# Altium schematic sheet LANtoLIN.SchDoc
size A4
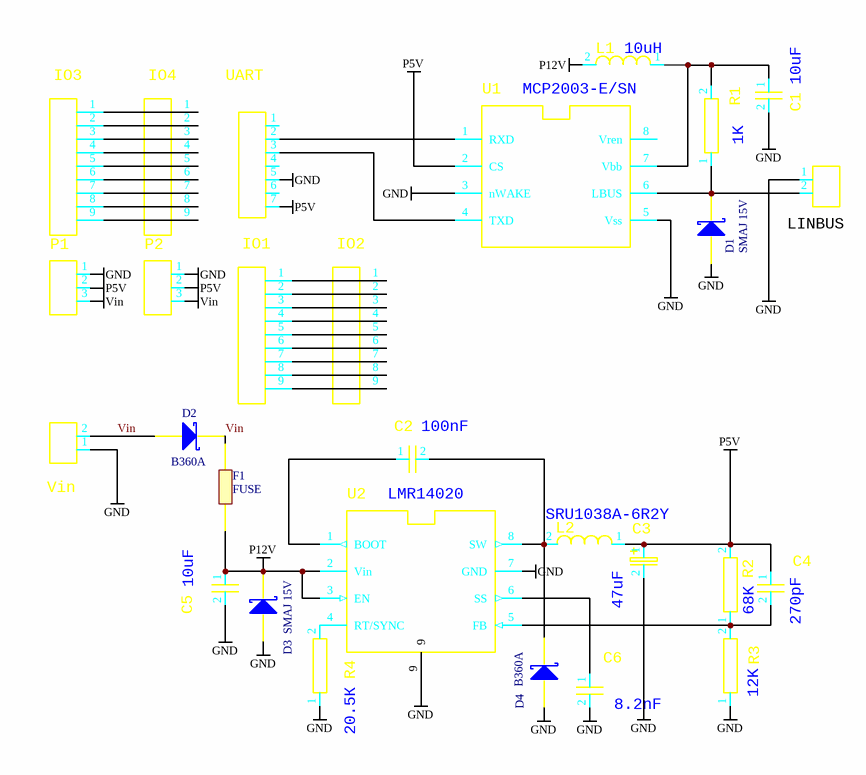
[diagram p0: LANtoLIN.SchDoc]

## Parts
C1  10uF  [C1210_N]
C2  100nF  [0805_N_2]
C3  47uF  [TANT_CASE_E]
C4  270pF  [1608[0603]]
C5  10uF  [C1210_N]
C6  8.2nF  [1608[0603]]
D1  SMAJ 15V  [SMA]
D2  B360A  [SMA]
D3  SMAJ 15V  [SMA]
D4  B360A  [SMA]
F1  FUSE  [CAPC4532L]
IO1  HEADER 9P S MALE  [CON-SRS-9-0254]  (value not drawn)
IO2  HEADER 9P S MALE  [CON-SRS-9-0254]  (value not drawn)
IO3  HEADER 9P S MALE  [CON-SRS-9-0254]  (value not drawn)
IO4  HEADER 9P S MALE  [CON-SRS-9-0254]  (value not drawn)
L1  10uH  [C1210_N]
L2  SRU1038A-6R2Y  [3232DZ (3232)]
LINBUS  2.54mm HEADER 2 PIN  [284391-2]  (value not drawn)
P1  HEADER 3P S MALE  [con-srs-3-0254]  (value not drawn)
P2  HEADER 3P S MALE  [con-srs-3-0254]  (value not drawn)
R1  1K  [C1210_N]
R2  68K  [1608[0603]]
R3  12K  [1608[0603]]
R4  20.5К  [1608[0603]]
U1  MCP2003-E/SN  [SO8 (REFLOW)]
U2  LMR14020  [S_SO8_POWER_PAD (wave)]
UART  HEADER 7P S MALE  [CON-SRS-7-0254]  (value not drawn)
Vin  2.54mm HEADER 2 PIN  [284391-2]  (value not drawn)

## Nets
GND: C1.2 C3.2 C5.2 C6.2 D1.1(A) D3.1(A) D4.1(A) LINBUS.1 P1.1 P2.1 R3.1 R4.1 U1.3(nWAKE) U1.5(Vss) U2.7(GND) U2.9 UART.5 Vin.1
P5V: C3.1 C4.1 L2.1 P1.2 P2.2 R2.2 U1.2(CS) UART.7
P12V: C5.1 D3.2(K) F1.1(A) L1.2 U2.2(Vin) U2.3(EN)
Vin: D2.1(A) D2.2(K) F1.2(K) P1.3 P2.3 Vin.2
NetC1_1: C1.1 L1.1 R1.2 U1.7(Vbb)
NetC2_1: C2.1 U2.1(BOOT)
NetC2_2: C2.2 D4.2(K) L2.2 U2.8(SW)
NetC4_2: C4.2 R2.1 R3.2 U2.5(FB)
NetC6_1: C6.1 U2.6(SS)
NetD1_2: D1.2(K) LINBUS.2 R1.1 U1.6(LBUS)
NetIO1_1: IO1.1 IO2.1
NetIO1_2: IO1.2 IO2.2
NetIO1_3: IO1.3 IO2.3
NetIO1_4: IO1.4 IO2.4
NetIO1_5: IO1.5 IO2.5
NetIO1_6: IO1.6 IO2.6
NetIO1_7: IO1.7 IO2.7
NetIO1_8: IO1.8 IO2.8
NetIO1_9: IO1.9 IO2.9
NetIO3_1: IO3.1 IO4.1
NetIO3_2: IO3.2 IO4.2
NetIO3_3: IO3.3 IO4.3
NetIO3_4: IO3.4 IO4.4
NetIO3_5: IO3.5 IO4.5
NetIO3_6: IO3.6 IO4.6
NetIO3_7: IO3.7 IO4.7
NetIO3_8: IO3.8 IO4.8
NetIO3_9: IO3.9 IO4.9
NetR4_2: R4.2 U2.4(RT/SYNC)
NetU1_1: U1.1(RXD) UART.2
NetU1_4: U1.4(TXD) UART.3

Not connected (* = marked no-connect by the designer): U1 8(Vren); UART 1 4 6

## Library data of the parts
C1 C5 = C100n-10%-0603: 10uF Surface mount CAP 1210 10% 25V; (OldCtfName): (CTF_OLD_NAME_INVALID); Value: 10uF; Tolerance: 10%; Voltage: 25V
C2 = C100n-10%-0603: 100nF Surface mount CAP 0603 10% 50V; (OldCtfName): (CTF_OLD_NAME_INVALID); Value: 100nF; Tolerance: 10%; Voltage: 50V
C3 = C330uF-63V--Polar: CAP, TANT, 200UF, 6.3V, CASE E; Voltage: 35V; Tolerance: 20%; (OldCtfName): (CTF_OLD_NAME_INVALID); Value: 47uF
C4 = C100n-10%-0603: 270pF Surface mount CAP 0603 10% 35V; (OldCtfName): (CTF_OLD_NAME_INVALID); Value: 270pF; Tolerance: 10%; Voltage: 35V
C6 = C100n-10%-0603: 8.2nF Surface mount CAP 0603 10% 35V; (OldCtfName): (CTF_OLD_NAME_INVALID); Value: 8.2nF; Tolerance: 10%; Voltage: 35V
D1 D3 = TVS_SMAJ15: TVS
D2 D4 = TVS_SMAJ15: B260A
F1 = FUSE_1A: FUSE POLISWITCH
IO1-IO4 = HEADER 9P S MALE: HEADER SINGLE ROW 8P STRAIGHT MALE; Elec_type: ON_BOARD_CONNECTOR; (OldCtfName): (CTF_OLD_NAME_INVALID)
L1 = XAL4030-332-MEB: Tolerance: 20%; Elec_type: SRU1038A-6R2Y; (OldCtfName): (CTF_OLD_NAME_INVALID); Value: 10uH
L2 = XAL4030-332-MEB: SRU1038A-6R2Y- INDUCTOR 6.8uH; Tolerance: 20%; (OldCtfName): (CTF_OLD_NAME_INVALID); Elec_type: SRU1038A-6R2Y; Value: SRU1038A-6R2Y
LINBUS Vin = HEADER 2P S MALE: HEADER SINGLE ROW 2P STRAIGHT MALE; Elec_type: ON_BOARD_CONNECTOR; (OldCtfName): (CTF_OLD_NAME_INVALID); Value: 2.54mm HEADER 2 PIN
P1 P2 = HEADER 3P S MALE: HEADER SINGLE ROW 3P STRAIGHT MALE; Elec_type: ON_BOARD_CONNECTOR; (OldCtfName): (CTF_OLD_NAME_INVALID)
R1 R2 = R10K-1%-0603: 68K SMD 0603 1%; Wattage: 0.065W; (OldCtfName): (CTF_OLD_NAME_INVALID); Tolerance: 1%
  R1: Value: 1K
  R2: Value: 68K
R3 = R10K-1%-0603: 12K SMD 0603 1%; Wattage: 0.065W; (OldCtfName): (CTF_OLD_NAME_INVALID); Value: 12K; Tolerance: 1%
R4 = R10K-1%-0603: 20.5К SMD 0603 1%; Wattage: 0.065W; (OldCtfName): (CTF_OLD_NAME_INVALID); Value: 20.5К; Tolerance: 1%
U1 = MCP2003-E/SN: LIN DRIVER MCP2003-E/SN; Manufacturer: MICROCHIP; (OldCtfName): (CTF_OLD_NAME_INVALID); Value: MCP2003-E/SN
U2 = LMR14020: 4-40V to 3.3V Buck; Manufacturer: TI; (OldCtfName): (CTF_OLD_NAME_INVALID); Value: LMR14020
UART = HEADER 7P S MALE: HEADER SINGLE ROW 6P STRAIGHT MALE; Elec_type: ON_BOARD_CONNECTOR; (OldCtfName): (CTF_OLD_NAME_INVALID)